# Altium schematic sheet VIBRO.SchDoc
size A4; SheetNumber: 10; SheetTotal: 11
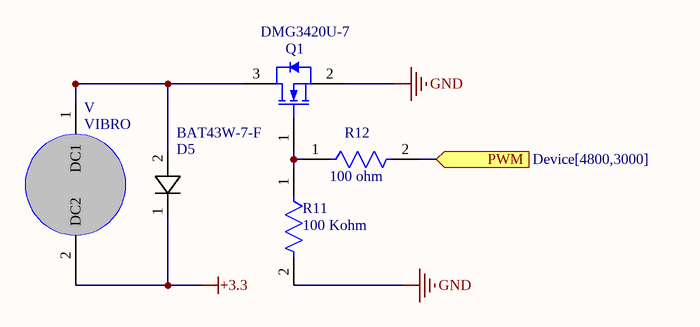
[diagram p0: VIBRO.SchDoc]

## Parts
D5  BAT43W-7-F  [BAT43W-7-F]
Q1  DMG3420U-7  [DIOD-SOT23-3_B_V]
R11  100 Kohm  [FP-RC1005-IPC_C]
R12  100 ohm  [FP-RC1005-IPC_C]
V  VIBRO  [VIBRO]

## Ports
PWM (in, see Device[4800,3000])

## Nets
+3.3: D5.1 V.2(DC2)
GND: Q1.2(S) R11.2
PWM: R12.2 ; port PWM
NetD5_2: D5.2 Q1.3(D) V.1(DC1)
NetQ1_1: Q1.1(G) R11.1 R12.1

## Library data of the parts
Q1 = CMP-2000-06172-1: N-Channel Enhancement Mode MOSFET, 20 V, -55 to 150 degC, 3-Pin SOT23, RoHS, Tape and Reel; Manufacturer: Diodes Inc; Drain-Source On Resistance-Max: 29mO; Qg Gate Charge: 5.4nC; Drain-to-Source Voltage [Vdss]: 20V; Rated Power Dissipation: 740mW; Datasheet URL: http://www.diodes.com/_files/datasheets/ds31867.pdf; Package Description: 3-Pin Small Outline Transistor, Body 2.9 x 1.3 mm, Pitch 0.96 mm; Package Reference: SOT23-3; Datasheet Version: Rev. 5-2, 09/2013; Mounting Technology: SurfaceMount; Channel Type: N-Channel; Manufacturer URL: http://www.diodes.com/
R11 R12 = CMP-13261-000953-1: Res Thick Film 0402 1.87kΩ 1% 0.063W ±100ppm/°C Molded SMD T/R; Power Rating: 63mW; Voltage Rating (DC): 50V; Resistance: 1.87kR; Tolerance: 1%; Height: 0.016inch; Length: 1mm; Case Code (Metric): 1005; Width: 0.02inch; Max Power Dissipation: 63mW; Radiation Hardening: No; Features: Moisture Resistant; Temperature Coefficient: 100ppm/°C; Min Operating Temperature: -55°C; Number of Terminations: 2; Max Operating Temperature: 155°C; Case Code (Imperial): 0402; Composition: Thick Film; Depth: 0.5mm; Lead Free: Lead Free; Package Quantity: 1; Case/Package: 0402; Packaging: Tape and Reel; Contact Plating: Tin; Military Standard: Not